# EAGLE design ESP32Board_V1 (EAGLE 9.6.2)
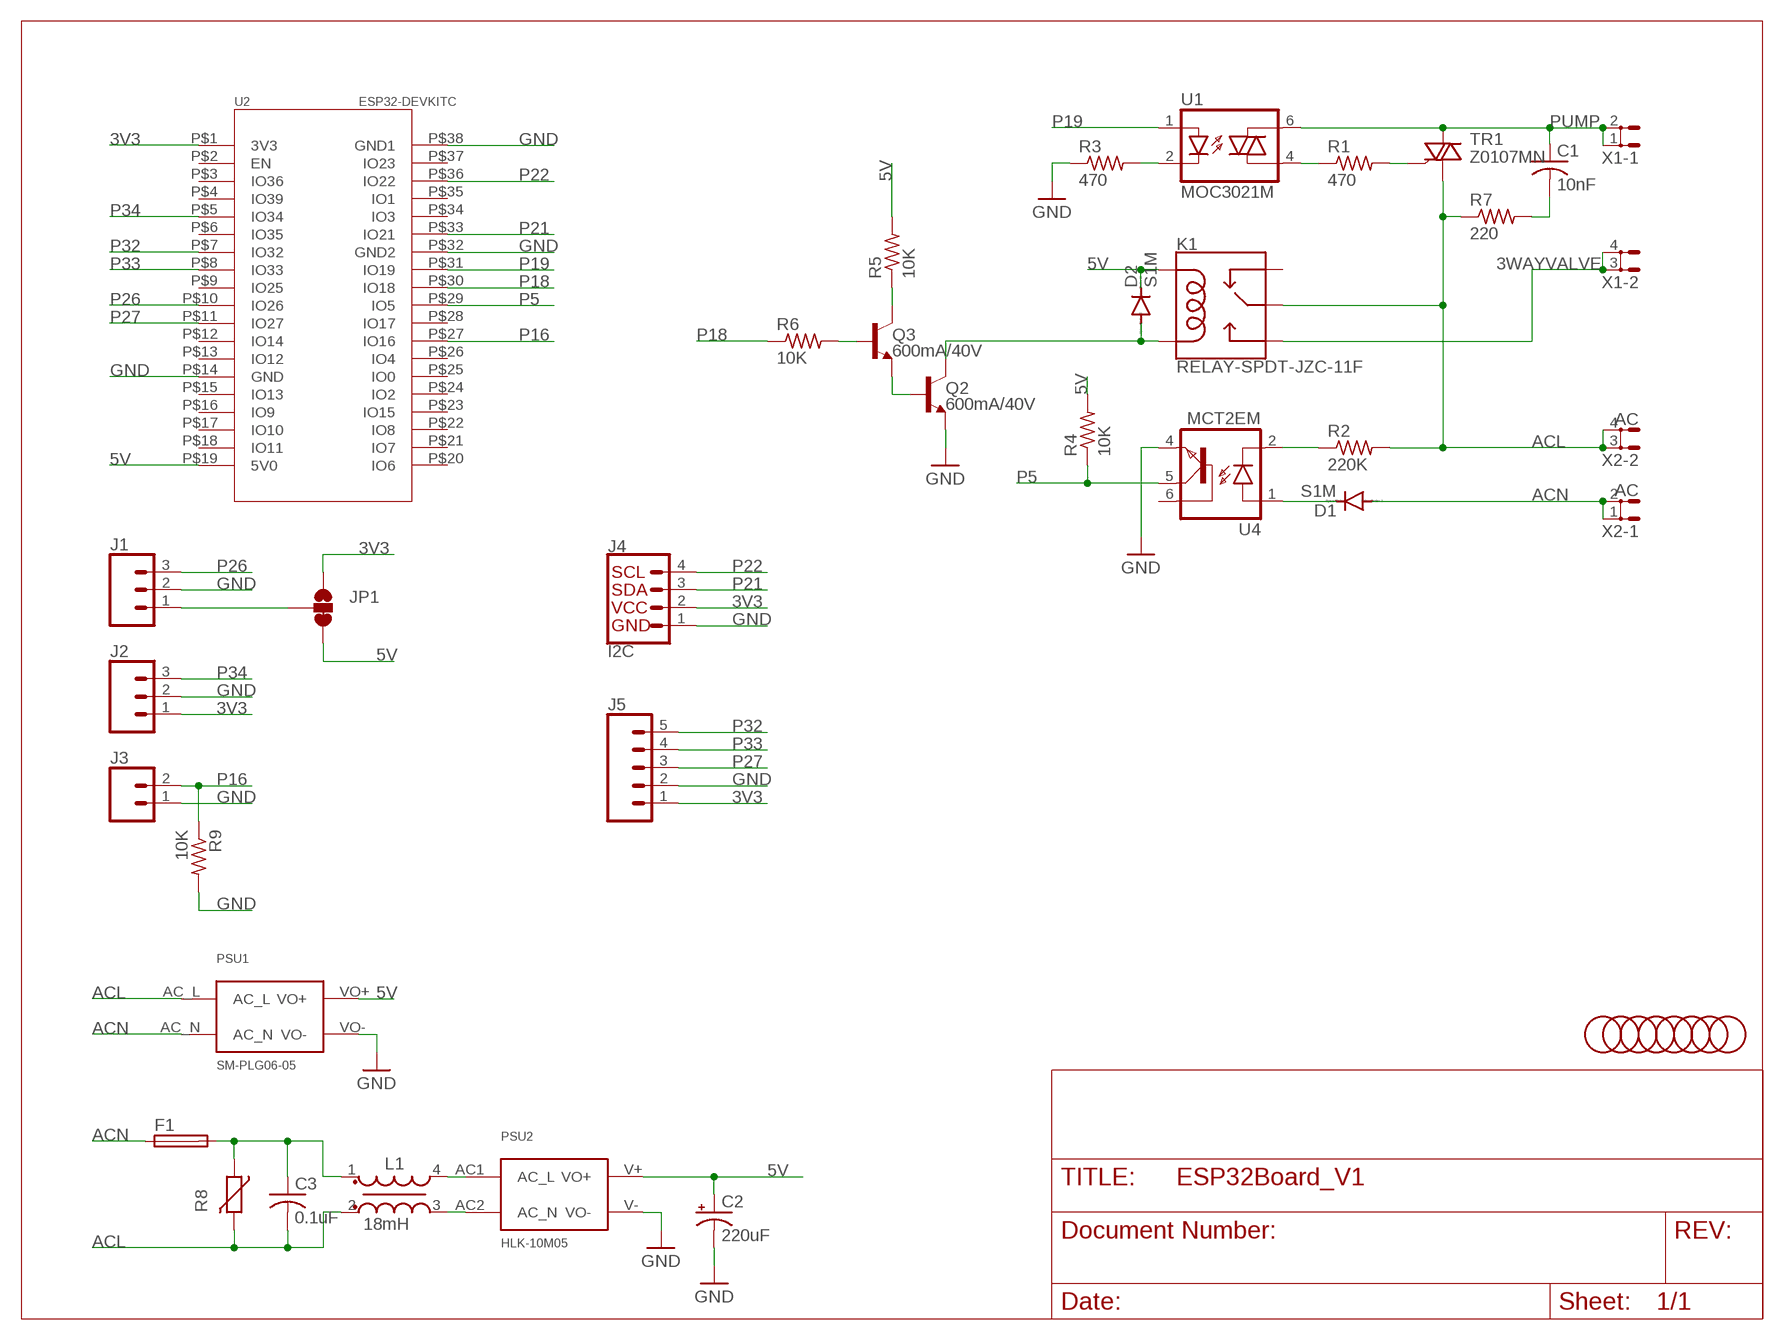
[diagram p0: schematic, sheet 1]

## Parts
C1  10nF  C-US075-032X103  [C075-032X103]
C2  220uF  CPOL-USE2.5-6  [E2,5-6]
C3  0.1uF  C-US150-054X183  [C150-054X183]
D1  S1M  [SMA]
D2  S1M  [SMA]
F1  FUSETE5  [TE5]
J1  CONN_03JST-PTH  [JST-3-PTH]
J2  CONN_03JST-PTH  [JST-3-PTH]
J3  CONN_02JST-PTH-2  [JST-2-PTH]
J4  I2C  QWIIC_CONNECTOR  [JST04_1MM_VERT]
J5  CONN_05JST  [JST-5-PTH]
JP1  JUMPER-SMT_3_1-NC_TRACE_SILK  [SMT-JUMPER_3_1-NC_TRACE_SILK]
K1  RELAY-SPDT-JZC-11F  [RELAY-JZC]
L1  18mH  WE-TFC_UU9.8V_744862180  [WE-TFC_UU9.8V]
PSU1  SM-PLG06-05  [SM-PLG06]
PSU2  HLK-10M05  [HLK-10MXX]
Q2  600mA/40V  TRANS_NPN-MMBT2222AL  [SOT23-3]
Q3  600mA/40V  TRANS_NPN-MMBT2222AL  [SOT23-3]
R1  470  R-US_R0603  [R0603]
R2  220K  R-US_R0603  [R0603]
R3  470  R-US_R0603  [R0603]
R4  10K  R-US_R0603  [R0603]
R5  10K  R-US_R0603  [R0603]
R6  10K  R-US_R0603  [R0603]
R7  220  R-US_R2512  [R2512]
R8  VARISTOR-7,5  [R-7,5]
R9  10K  R-US_R0603  [R0603]
TR1  Z0107MN  Z0107MNSOT-223  [SOT223]
U1  MOC3021M  [DIL06]
U2  ESP32-DEVKITC  [ESP32-DEVKITC]
U4  MCT2EM  [PDIP6_8P89X6P60_ONS]
U$1  FIDUCIAL  [FIDUCIAL_1MM]
U$2  FIDUCIAL  [FIDUCIAL_1MM]
U$3  FIDUCIAL  [FIDUCIAL_1MM]
U$4  FIDUCIAL  [FIDUCIAL_1MM]
U$5  FIDUCIAL  [FIDUCIAL_1MM]
U$6  FIDUCIAL  [FIDUCIAL_1MM]
U$7  FIDUCIAL  [FIDUCIAL_1MM]
U$8  FIDUCIAL  [FIDUCIAL_1MM]
X1  SH5-2  [SH5-2]
X2  AC  SH5-2  [SH5-2]

## Nets
3V3: J2.1 J4.2 J5.1 JP1.1 U2.P$1(3V3)
3WAYVALVE: K1.3(NO) X1.3 X1.4
5V: C2.+ D2.C JP1.3 K1.5(COIL1) PSU1.VO+ PSU2.V+(VO+) R4.2 R5.2 U2.P$19(5V0)
ACL: C3.2 K1.4(MAIN) L1.2 PSU1.AC_L R2.2 R7.1 R8.2 TR1.1(A1) X2.3 X2.4
ACN: D1.A F1.1 PSU1.AC_N X2.1 X2.2
ACN1: C3.1 F1.2 L1.1 R8.1
GND: C2.- J1.2 J2.2 J3.1 J4.1 J5.2 PSU1.VO- PSU2.V-(VO-) Q2.2(E) R3.1 R9.2 U2.P$14(GND) U2.P$32(GND2) U2.P$38(GND1) U4.4(EMI)
N$1: R1.1 U1.4(A1)
N$2: R1.2 TR1.3(G)
N$3: R3.2 U1.2(C)
N$4: C1.2 R7.2
N$5: R2.1 U4.2(C)
N$6: D1.C U4.1(A)
N$7: L1.4 PSU2.AC1(AC_L)
N$8: Q2.1(B) Q3.2(E)
N$9: D2.A K1.1(COIL2) Q2.3(C)
N$10: Q3.3(C) R5.1
N$11: Q3.1(B) R6.2
N$12: L1.3 PSU2.AC2(AC_N)
N$13: J1.1 JP1.2
P5: R4.1 U2.P$29(IO5) U4.5(COL)
P16: J3.2 R9.1 U2.P$27(IO16)
P18: R6.1 U2.P$30(IO18)
P19: U1.1(A) U2.P$31(IO19)
P21: J4.3 U2.P$33(IO21)
P22: J4.4 U2.P$36(IO22)
P26: J1.3 U2.P$10(IO26)
P27: J5.3 U2.P$11(IO27)
P32: J5.5 U2.P$7(IO32)
P33: J5.4 U2.P$8(IO33)
P34: J2.3 U2.P$5(IO34)
PUMP: C1.1 TR1.2(A2) TR1.4(A2) U1.6(A2) X1.1 X1.2
Unconnected: K1.2(NC) U2.P$2(EN) U2.P$3(IO36) U2.P$4(IO39) U2.P$6(IO35) U2.P$9(IO25) U2.P$12(IO14) U2.P$13(IO12) U2.P$15(IO13) U2.P$16(IO9) U2.P$17(IO10) U2.P$18(IO11) U2.P$20(IO6) U2.P$21(IO7) U2.P$22(IO8) U2.P$23(IO15) U2.P$24(IO2) U2.P$25(IO0) U2.P$26(IO4) U2.P$28(IO17) U2.P$34(IO3) U2.P$35(IO1) U2.P$37(IO23) U4.6(BAS)

## Library data of the parts
C1 = rcl:C-US: CAPACITOR, American symbol; BOM_SUPPLIER: LCSC; BOM_SUPPLIERPART: C506848; SPICEPREFIX: C
C2 = rcl:CPOL-US: POLARIZED CAPACITOR, American symbol; SPICEPREFIX: C
C3 = rcl:C-US: CAPACITOR, American symbol; SPICEPREFIX: C
D1 D2 = diode:S1M; BOM_SUPPLIER: LCSC; BOM_SUPPLIERPART: C232826
F1 = fuse:FUSE: Fuse; OC_FARNELL: unknown; OC_NEWARK: unknown
J1 J2 = SparkFun-Connectors:CONN_03: Multi connection point. Often used as Generic Header-pin footprint for 0.1 inch spaced/style header connections On any of the 0.1 inch spaced packages, you can populate with these: Break Away Headers - Straight <https://www.sparkfun.com/products/116> (PRT-00116) Break Away Male Headers - Right Angle <https://www.sparkfun.com/products/553> (PRT-00553) Female Headers <https://www.sparkfun.com/products/115> (PRT-00115) Break Away Headers - Machine Pin <https://www.sparkfun.com/products/117> (PRT-00117) Break Away Female Headers - Swiss Machine Pin <https://www.sparkfun.com/products/743> (PRT-00743) Stackable Header - 3 Pin (Female, 0.1") <https://www.sparkfun.com/products/13875> (PRT-13875) For SCREWTERMINALS and SPRING TERMINALS visit here: Screw Terimnals on SparkFun.com <https://www.sparkfun.com/search/results?term=Screw+Terminals> (5mm/3.5mm/2.54mm spacing) This device is also useful as a general connection point to wire up your design to another part of your project. Our various solder wires solder well into these plated through hole pads. Hook-Up Wire - Assortment (Stranded, 22 AWG) <https://www.sparkfun.com/products/11375> (PRT-11375) Hook-Up Wire - Assortment (Solid Core, 22 AWG) <https://www.sparkfun.com/products/11367> (PRT-11367) View the entire wire category on our website here <https://www.sparkfun.com/categories/141> Special notes: Molex polarized connector foot print use with SKU : PRT-08232 with associated crimp pins and housings.; BOM_SUPPLIER: LCSC; BOM_SUPPLIERPART: C157929; PROD_ID: WIRE-10037; SF_ID: PRT-09915
J3 = SparkFun-Connectors:CONN_02: Multi connection point. Often used as Generic Header-pin footprint for 0.1 inch spaced/style header connections On any of the 0.1 inch spaced packages, you can populate with these: Break Away Headers - Straight <https://www.sparkfun.com/products/116> (PRT-00116) Break Away Male Headers - Right Angle <https://www.sparkfun.com/products/553> (PRT-00553) Female Headers <https://www.sparkfun.com/products/115> (PRT-00115) Break Away Headers - Machine Pin <https://www.sparkfun.com/products/117> (PRT-00117) Break Away Female Headers - Swiss Machine Pin <https://www.sparkfun.com/products/743> (PRT-00743) For SCREWTERMINALS and SPRING TERMINALS visit here: Screw Terimnals on SparkFun.com <https://www.sparkfun.com/search/results?term=Screw+Terminals> (5mm/3.5mm/2.54mm spacing) This device is also useful as a general connection point to wire up your design to another part of your project. Our various solder wires solder well into these plated through hole pads. Hook-Up Wire - Assortment (Stranded, 22 AWG) <https://www.sparkfun.com/products/11375> (PRT-11375) Hook-Up Wire - Assortment (Solid Core, 22 AWG) <https://www.sparkfun.com/products/11367> (PRT-11367) View the entire wire category on our website here <https://www.sparkfun.com/categories/141> Special notes: Molex polarized connector foot print use with: PRT-08233 with associated crimp pins and housings. 2.54_SCREWTERM for use with PRT-10571. 3.5mm Screw Terminal footprints for PRT-08084 5mm Screw Terminal footprints for use with PRT-08432; BOM_SUPPLIER: LCSC; BOM_SUPPLIERPART: C173752; PROD_ID: CONN-09863; SKU: PRT-09914
J4 = SparkFun-Connectors:QWIIC_CONNECTOR: SparkFun I2C Standard Qwiic Connector An SMD 1mm pitch JST connector makes it easy and quick (get it? Qwiic?) to connect I2C devices to each other. The Qwiic system <http://www.sparkfun.com/qwiic> enables fast and solderless connection between popular platforms and various sensors and actuators. We carry 200mm <https://www.sparkfun.com/products/14204>, 100mm <https://www.sparkfun.com/products/14205>, 50mm <https://www.sparkfun.com/products/14206>, and breadboard friendly <https://www.sparkfun.com/products/14207> Qwiic cables. We also offer 10 pcs strips <https://www.sparkfun.com/products/14323> the SMD connectors.; BOM_SUPPLIER: LCSC; BOM_SUPPLIERPART: C160390; PROD_ID: CONN-14483; VALUE: Vertical Qwiic Connector
J5 = SparkFun-Connectors:CONN_05: Multi connection point. Often used as Generic Header-pin footprint for 0.1 inch spaced/style header connections On any of the 0.1 inch spaced packages, you can populate with these: Break Away Headers - Straight <https://www.sparkfun.com/products/116> (PRT-00116) Break Away Male Headers - Right Angle <https://www.sparkfun.com/products/553> (PRT-00553) Female Headers <https://www.sparkfun.com/products/115> (PRT-00115) Break Away Headers - Machine Pin <https://www.sparkfun.com/products/117> (PRT-00117) Break Away Female Headers - Swiss Machine Pin <https://www.sparkfun.com/products/743> (PRT-00743) For SCREWTERMINALS and SPRING TERMINALS visit here: Screw Terimnals on SparkFun.com <https://www.sparkfun.com/search/results?term=Screw+Terminals> (5mm/3.5mm/2.54mm spacing) This device is also useful as a general connection point to wire up your design to another part of your project. Our various solder wires solder well into these plated through hole pads. Hook-Up Wire - Assortment (Stranded, 22 AWG) <https://www.sparkfun.com/products/11375> (PRT-11375) Hook-Up Wire - Assortment (Solid Core, 22 AWG) <https://www.sparkfun.com/products/11367> (PRT-11367) View the entire wire category on our website here <https://www.sparkfun.com/categories/141> Special notes: Molex polarized connector foot print use with SKU : PRT-08231 with associated crimp pins and housings. 1MM SMD Version SKU: PRT-10208; BOM_SUPPLIER: LCSC; BOM_SUPPLIERPART: C157923; SF_ID: PRT-09917
JP1 = SparkFun-Jumpers:JUMPER-SMT_3_1-NC_TRACE: Normally closed trace jumper (1 of 2 connections) This jumper has a trace between two pads so it's normally closed (NC). The other connection is normally open (NO). Use a razor knife to open the connection. For best results follow the IPC guidelines for cutting traces: Cutout at least 0.063 mm (0.005 in). Remove all loose material to clean up the cut area. Seal the cut with an approved epoxy. Reapply solder to reclose the connection, or to close the NO connection.
K1 = SparkFun-Electromechanical:RELAY-SPDT: SPDT Electromechanical Relay Single-pole, double-throw sealed relays. When current is applied to the coil, it throws a simple changeover switch, terminating the connection from the NC contact to ground and closing the NO contact. Use them to switch high voltage/high current devices. SparkFun Products JQX-15F: Relay SPDT Sealed - 20A <https://www.sparkfun.com/products/10924> (COM-10924) JZC-11F: Relay SPDT Sealed <https://www.sparkfun.com/products/100> (COM-00100); BOM_SUPPLIER: LCSC; BOM_SUPPLIERPART: C355393; PROD_ID: COMP-09533; SF_SKU: COM-00100
L1 = Wurth_EMC Components_WE-TFC:WE-TFC_UU9.8V: WE-TFC Common Mode Power Line Choke Characteristics Suppression of common mode noise up to 70 dB Approximate 1% stray inductance for symmetrical interference suppression High isolation between the windings Flammability corresponding to UL 94 V-0 Clima category 40/125/21 Applications Mains filter Compact switched-mode power supplies Electronic ballast applications (LED bulb) Lighting White goods <https://www.we-online.de/katalog/media/o182603v209%20Family_WE-TFC_UU9.8V_UU9.8H_744861xxx_744862xxx.jpg> Details see: https://www.we-online.de/katalog/en/WE-TFC Updated by Ella Wu 2021-02-04 2021 (C) Wurth Elektronik; DATASHEET-URL: https://www.we-online.com/catalog/datasheet/744862180.pdf; IR: 0.3A; MOUNT: THT; PART-NUMBER: 744862180; RDC: 3.1Ohm; VR: 300 V (AC); VT: 2500 V (AC)
PSU1 = discrete:SM-PLG06-05: AC-DC 5V Isolated Switching Power Supply Module
PSU2 = discrete:HLK-10M05: HLK-10M05 10W power 5V output AC-DC power module
Q2 Q3 = SparkFun-DiscreteSemi:TRANS_NPN: NPN transistor Current controlled devices typically used to amplify current or used as a switch. BC547 - COM-08928 <http://www.sparkfun.com/products/8928> (TO-92 45V 100mA) (1.Collector 2.Base 3.Emitter) 2N3904 - COM-00521 <http://www.sparkfun.com/products/521> (TO-92 40V 200mA) (1.Emitter 2.Base 3.Collector) P2N2222A - COM-12852 <http://www.sparkfun.com/products/12852> (TO-92 40V 600mA) (1.Collector 2.Base 3.Emitter); BOM_SUPPLIER: LCSC; BOM_SUPPLIERPART: C164886; PROD_ID: TRANS-08049
R1 R3 = rcl:R-US_: RESISTOR, American symbol; BOM_SUPPLIER: LCSC; BOM_SUPPLIERPART: C328361; SPICEPREFIX: R
R2 = rcl:R-US_: RESISTOR, American symbol; BOM_SUPPLIER: LCSC; BOM_SUPPLIERPART: C217882; SPICEPREFIX: R
R4-R6 R9 = rcl:R-US_: RESISTOR, American symbol; BOM_SUPPLIER: LCSC; BOM_SUPPLIERPART: C319939; SPICEPREFIX: R
R7 = rcl:R-US_: RESISTOR, American symbol; BOM_SUPPLIER: LCSC; BOM_SUPPLIERPART: C416197; SPICEPREFIX: R
R8 = varistor:VARISTOR: VARISTOR
TR1 = discrete:Z0107MN: Triacs 1.0 Amp 600 Volt; BOM_SUPPLIER: LCSC; BOM_SUPPLIERPART: C71218
U1 = discrete:MOC3021M: RANDOM-PHASE OPTOISOLATORS TRIAC DRIVER OUTPUT; BOM_SUPPLIER: LCSC; BOM_SUPPLIERPART: C5242
U2 = discrete:ESP32-DEVKITC: ESP32-DEVKITC
U4 = MCT2EM_Sym:MCT2EM; BOM_SUPPLIER: LCSC; BOM_SUPPLIERPART: C258259; COPYRIGHT: Copyright (C) 2021 Ultra Librarian. All rights reserved.; MANUFACTURER_PART_NUMBER: MCT2EM; MFR_NAME: ON Semiconductor
U$1-U$8 = adafruit:FIDUCIAL: For use by pick and place machines to calibrate the vision/machine, 1mm By microbuilder.eu
X1 X2 = con-rib:SH5-2: RIBBON CABLE CONNECTOR Flachstecker / Faston; BOM_SUPPLIER: LCSC; BOM_SUPPLIERPART: C305817; OC_FARNELL: unknown; OC_NEWARK: unknown

## Board
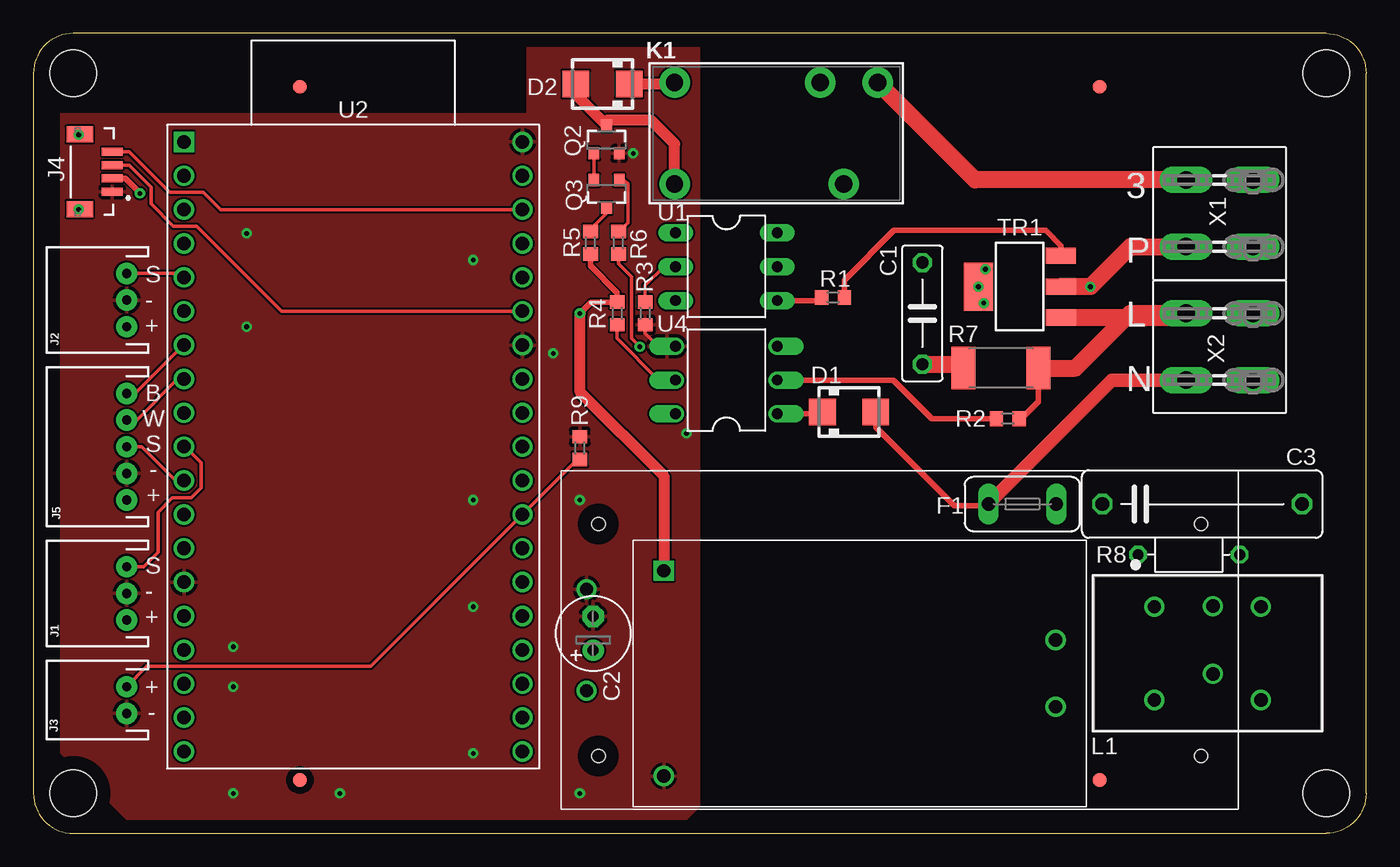
[diagram p1: board, top side]
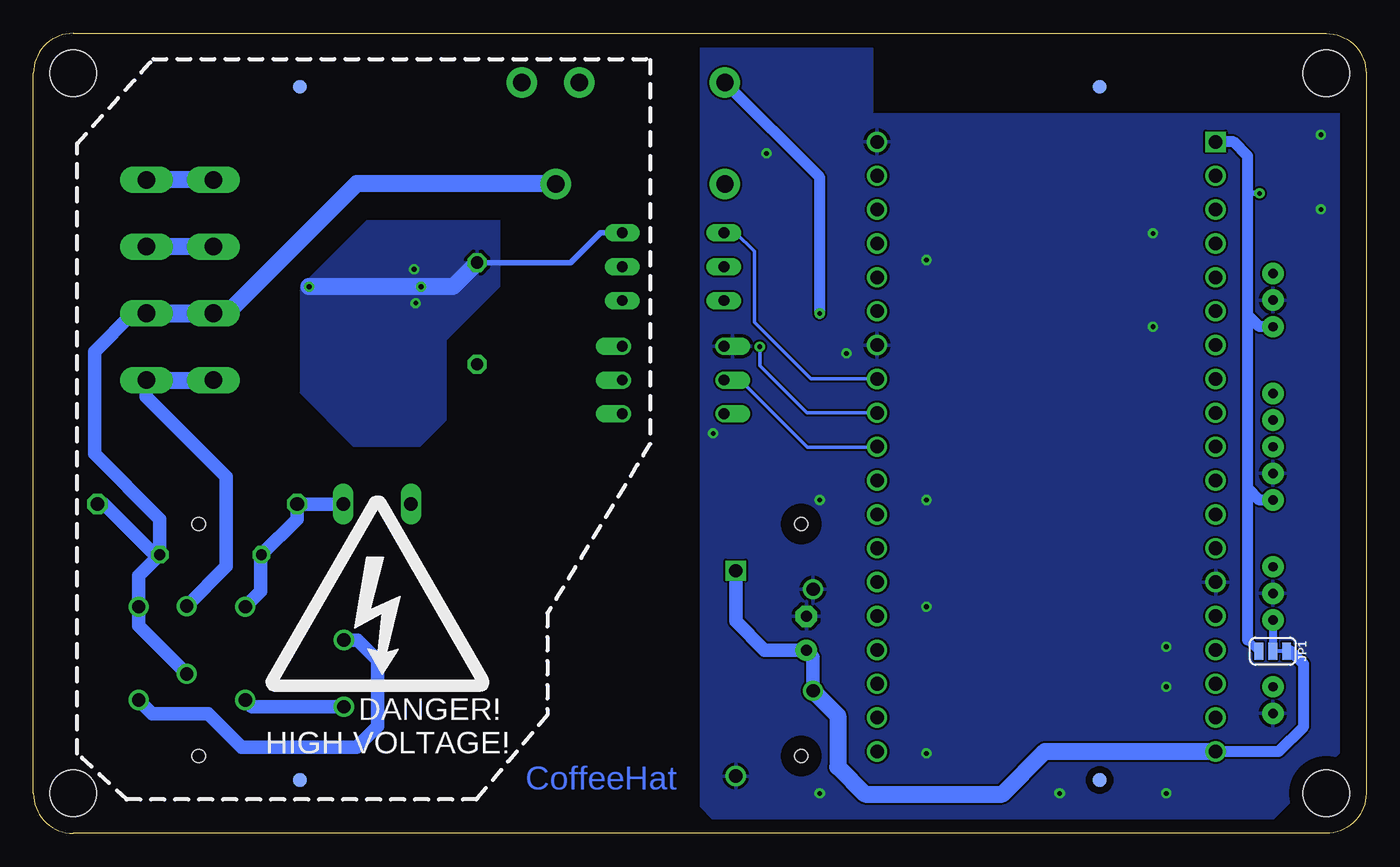
[diagram p2: board, bottom side, seen from below]

Size 100 x 60 mm. Coordinates in mm from the lower left corner, seen from the top.
Outline: 3,0 97,0 arc90 100,3 100,57 arc90 97,60 3,60 arc90 0,57 0,3 arc90 3,0
Copper layers (1*16): Top 0.035mm / dielectric 1.5mm / Bottom 0.035mm
Design rules "default": minimum track width 6mil, minimum drill 0.35mm, track to track 6mil, track to pad 6mil, pad to pad 6mil, via to via 6mil, smd to smd 6mil, copper to edge 40mil, drill to drill 6mil, minimum pad ring 10mil, minimum via ring 8mil, stop-mask expansion 4mil, vias tented up to drill 0mil, thermal gap 10mil
Holes 3.5 mm at 3,3 3,57 97,57 97,3

### Footprints (pad centres in the part's own frame; a part is rotated, then mirrored left to right if it is on the bottom)
C075-032X103 = drill 0.914 octagon: 1 -3.81,0; 2 3.81,0
E2,5-6 = drill 0.813 pad 1.6: + -1.27,0 | drill 0.813 pad 1.6 octagon: - 1.27,0
C150-054X183 = drill 1.016 octagon: 1 -7.493,0; 2 7.493,0
SMA = smd 2 x 2: A 2,0; C -2,0
TE5 = drill 1.016 long: 1 -2.54,0; 2 2.54,0
JST-3-PTH = drill 0.7 pad 1.6: 1 -2,0; 2 0,0; 3 2,0
JST-2-PTH = drill 0.7 pad 1.6: 1 -1,0; 2 1,0
JST04_1MM_VERT = smd 0.6 x 1.55: 1 -1.478,0.775; 2 -0.478,0.775; 3 0.522,0.775; 4 1.522,0.775 | smd 1.2 x 2: NC1 -2.778,3.2; NC2 2.822,3.2
JST-5-PTH = drill 0.7 pad 1.6: 1 -4,0; 2 -2,0; 3 0,0; 4 2,0; 5 4,0
SMT-JUMPER_3_1-NC_TRACE_SILK = smd 0.66 x 1.27: 1 -1.041,0; 2 0,0; 3 1.041,0
RELAY-JZC = drill 1.3 pad 2.286: 1 3.81,-8.89; 2 -3.81,2.032; 3 -3.81,6.35; 4 3.81,3.81; 5 -3.81,-8.89
WE-TFC_UU9.8V = drill 1: 1 -4,3.5; 2 4,3.5; 3 4,-3.5; 4 -4,-3.5
SM-PLG06 = drill 1: AC_L -23.5,2.54; AC_N -23.5,-2.54; VO+ 23.5,3.81; VO- 23.5,-3.81 | hole 1: -22.6,8.7; -22.6,-8.7; 22.6,8.7; 22.6,-8.7
HLK-10MXX = drill 1: AC1 -14.7,2.5; AC2 -14.7,-2.5; V- 14.7,7.7 | drill 1 square: V+ 14.7,-7.7
SOT23-3 = smd 0.8 x 0.9: 1 -0.95,-1; 2 0.95,-1; 3 0,1.1
R0603 = smd 1 x 1.1: 1 -0.85,0; 2 0.85,0
R2512 = smd 1.8 x 3.2: 1 -2.8,0; 2 2.8,0
R-7,5 = drill 0.813 octagon: 1 -3.81,0; 2 3.81,0
SOT223 = smd 1.219 x 2.235: 1 -2.311,-3.099; 2 0,-3.099; 3 2.311,-3.099 | smd 3.6 x 2.2: 4 0,3.099
DIL06 = drill 0.813 long: 1 -2.54,-3.81; 2 0,-3.81; 3 2.54,-3.81; 4 2.54,3.81; 5 0,3.81; 6 -2.54,3.81
ESP32-DEVKITC = drill 1.016 square: P$1 -22.86,-12.7 | drill 1.016: P$2 -20.32,-12.7; P$3 -17.78,-12.7; P$4 -15.24,-12.7; P$5 -12.7,-12.7; P$6 -10.16,-12.7; P$7 -7.62,-12.7; P$8 -5.08,-12.7; P$9 -2.54,-12.7; P$10 0,-12.7; P$11 2.54,-12.7; P$12 5.08,-12.7; P$13 7.62,-12.7; P$14 10.16,-12.7; P$15 12.7,-12.7; P$16 15.24,-12.7; P$17 17.78,-12.7; P$18 20.32,-12.7; P$19 22.86,-12.7; P$20 22.86,12.7; P$21 20.32,12.7; P$22 17.78,12.7; P$23 15.24,12.7; P$24 12.7,12.7; P$25 10.16,12.7; P$26 7.62,12.7; P$27 5.08,12.7; P$28 2.54,12.7; P$29 0,12.7; P$30 -2.54,12.7; P$31 -5.08,12.7; P$32 -7.62,12.7; P$33 -10.16,12.7; P$34 -12.7,12.7; P$35 -15.24,12.7; P$36 -17.78,12.7; P$37 -20.32,12.7; P$38 -22.86,12.7
PDIP6_8P89X6P60_ONS = drill 0.813 offset: 1 -2.54,-3.81; 2 0,-3.81; 3 2.54,-3.81; 4 2.54,3.81; 5 0,3.81; 6 -2.54,3.81
FIDUCIAL_1MM = smd 1 x 1: 1 0,0
SH5-2 = drill 1.321 long: 1 0,-2.515; 2 0,2.515; 3 5.004,-2.515; 4 5.004,2.515

### Placement (x,y rotation side)
C1  66.7,39 270 top
C2  42,15 90 top
C3  87.7,24.7 0 top
D1  61.2,31.6 0 top
D2  42.7,56.2 180 top
F1  74.2,24.7 0 top
J1  7,18 90 top
J2  7,40 90 top
J3  7,10 90 top
J4  6.69,49.6 90 top
J5  7,29 90 top
JP1  7.01,13.66 0 bottom
K1  57,52.5 270 top
L1  88.1,13.5 0 top
PSU1  65,14.5 180 top
PSU2  62,12 180 top
Q2  43,52 0 top
Q3  43,48 180 top
R1  60,40.2 0 top
R2  73.1,31.1 0 top
R3  45.9,39 90 top
R4  43.8,39 90 top
R5  41.8,44.3 270 top
R6  43.9,44.3 90 top
R7  72.6,34.9 180 top
R8  86.7,20.9 0 top
R9  41,28.9 90 top
TR1  74,41 90 top
U1  52,42.5 270 top
U2  24,29 270 top
U4  52,34 90 top
U$1  20,56 0 top
U$2  20,4 0 top
U$3  20,56 0 bottom
U$4  20,4 0 bottom
U$5  80,56 0 top
U$6  80,56 0 bottom
U$7  80,4 0 bottom
U$8  80,4 0 top
U$9  [HV_LOGO_3]  83.01,10.67 0 bottom
X1  89,44 90 top
X2  89,34 90 top

### Tracks (layer width: path | path; a pad name or v marks a point on that pad's centre or on a via)
3V3  (via drill 0.35)
  Top 0.406: v8,48 6.88,49.12 J4.2
  Bottom 0.406: v8,48 v8.01,48.01 8.89,48.01
  Bottom 0.61: JP1.1 8.89,14.5
  Bottom 0.813: 8.89,38.87 8.89,48.01 8.89,50.8 9.95,51.86 U2.P$1 | J5.1 8.02,25 8.89,25.87 | 8.89,25.87 8.89,38.87 | J2.1 8.02,38 8.89,38.87 | 8.89,14.5 8.89,25.87
3WAYVALVE
  Top 1.27: X1.4 70.65,49 K1.3
  Bottom 1.27: X1.4 X1.3
5V  (via drill 0.35)
  Top 0.406: R5.2 41.8,42.56 43.8,40.56 R4.2 41.85,39.85 v41,39
  Top 0.813: D2.C 48,56.2 K1.5 | PSU2.V+ 47.3,26.81 41.02,33.09 41.02,38.98 v41,39
  Bottom 0.305: 5.66,13.66 JP1.3
  Bottom 0.813: v41,39 41,49.2 K1.5 | U2.P$19 6.56,6.14 4.7,8 4.7,12.7 5.66,13.66
  Bottom 1.016: PSU1.VO+ 41.49,13.22 C2.+ 45.14,13.73 47.3,15.89 PSU2.V+
  Bottom 1.27: PSU1.VO+ 39.65,8.84 39.65,4.99 37.6,2.94 27.3,2.94 24.09,6.14 U2.P$19
ACL
  Top 0.406: R7.1 75.4,32.36 74.14,31.1 R2.2
  Top 1.27: R7.1 78.19,34.9 82.3,39 X2.4 86.17,38.69 TR1.1
  Bottom 1.016: X2.3 92.53,39 95.4,36.13 95.4,28.46 90.51,23.57 R8.2 | C3.2 94.69,24.7 90.89,20.9 R8.2 | R8.2 92.1,19.31 L1.2 92.1,15.56 PSU1.AC_L
  Bottom 1.27: X2.4 X2.3 91.44,38.92 85.53,38.92 75.72,48.74 60.86,48.74 K1.4
ACN
  Top 0.406: D1.A 63.2,30.46 69.09,24.57 71.53,24.57
  Top 1.016: X2.2 80.93,34 71.66,24.73 F1.1 71.53,24.57
  Bottom 1.016: PSU1.AC_N 85.52,20.02 85.52,26.73 91.52,32.73 X2.1
  Bottom 1.27: X2.1 X2.2
ACN1
  Bottom 1.016: F1.2 C3.1 80.22,24.68 80.22,23.57 R8.1 82.96,20.83 82.96,18.14 L1.1
GND  (via drill 0.35)
  Top 0.254: U4.4 46.88,36.54 45.9,37.52 R3.1
  other vias: 49,30 45,51 16,45 16,38 33,43 33,25 33,17 15,14 15,11 15,3 23,3 33,6 41,3 41,25 39,36 3.4,52.4 3.4,46.8
  pour Top: 2,54 37,54 37,59 50,59 50,2 49,1 7,1 2,6
  pour Bottom: 2,54 37,54 37,59 50,59 50,2 49,1 7,1 2,6
N$1
  Top 0.406: R1.1 58.91,39.96 U1.4
N$2
  Top 0.406: TR1.3 77.1,44.07 75.96,45.22 64.58,45.22 60.85,41.49 R1.2
N$3
  Top 0.254: R3.2 45.9,41.1 47.3,42.5 U1.2
N$4
  Top 1.27: C1.2 66.74,35.15 69.55,35.15 R7.2
N$5
  Top 0.406: R2.1 67.42,31.1 64.52,34 U4.2
N$6
  Top 0.406: D1.C 59.06,31.46 U4.1
N$7
  Bottom 1.016: L1.4 83.6,9.5 PSU2.AC1
N$8
  Top 0.254: Q3.2 Q2.1
N$9
  Top 0.813: K1.1 48.11,51.71 46.35,53.47 43,53.47 Q2.3 40.7,55.4 D2.A
N$10
  Top 0.254: R5.1 41.8,45.32 43,46.52 Q3.3
N$11
  Top 0.254: Q3.1 44.33,49 44.61,48.72 44.61,45.78 43.98,45.15 R6.2
N$12
  Bottom 1.016: L1.3 91.08,8.98 86.89,8.98 84.35,6.44 75.74,6.44 74.16,8.02 74.16,12.98 75.68,14.5 PSU2.AC2
N$13
  Bottom 0.61: J1.1 7,13.67 JP1.2
P5
  Top 0.254: R4.1 43.8,37.12 46.92,34 U4.5
  Bottom 0.254: U2.P$29 36.73,28.97 41.92,28.97 46.95,34 U4.5
P16
  Top 0.254: J3.2 8.52,12.52 25.3,12.52 U2.P$27 40.83,28.05 R9.1
P18  (via drill 0.35)
  Top 0.254: v45.5,36.5 44.87,37.13 44.87,41.75 43.9,42.72 R6.1
  Bottom 0.254: v45.5,36.5 45.5,35.07 41.97,31.54 U2.P$30
P19
  Bottom 0.254: U1.1 47.3,45.04 45.9,43.64 45.9,38.33 41.65,34.08 U2.P$31
P21
  Top 0.254: U2.P$33 18.61,39.16 12.24,45.53 10.5,45.53 8.84,47.2 8.84,48.47 7.18,50.12 J4.3
P22
  Top 0.254: U2.P$36 14.04,46.78 12.75,48.08 10.23,48.08 7.18,51.12 J4.4
P26
  Top 0.254: J1.3 8.27,20 9.37,21.1 9.37,24.1 10.44,25.16 11.86,25.16 12.6,25.9 12.6,27.78 11.38,29 U2.P$10
P27
  Top 0.254: J5.3 8.14,29 10.68,26.46 U2.P$11
P32
  Top 0.254: J5.5 7.63,33 11.26,36.62 U2.P$7
P33
  Top 0.254: J5.4 7.76,31 10.84,34.08 U2.P$8
P34
  Top 0.254: J2.3 11,42 U2.P$5
PUMP  (via drill 0.35)
  Top 0.406: v71.44,42.31 71.44,41.53 TR1.4 71.31,40.59 v71.31,39.77
  Top 1.27: TR1.2 v79.31,41 82.31,44 X1.2
  Bottom 0.406: C1.1 59.69,42.81 57.46,45.04 U1.6
  Bottom 1.27: X1.2 X1.1 | C1.1 68.51,41 v79.31,41
  other vias: 70.9,41
  pour Bottom: 65,46 75,46 80,41 80,33 76,29 71,29 69,31 69,37 65,41

### Text on the board
Bottom: CoffeeHat
tPlace: S / - / + | B / W / S / - / + | S / - / + | + / -
bPlace: DANGER! / HIGH VOLTAGE!
tNames: 3 / P / L / N